# Altium schematic sheet PSU_MAX8860_ADJ.SchDoc: Power Supply MAX8860 (2V5)
size A4; DrawnBy: Brett Muir; SheetNumber: 10; SheetTotal: 12; PageSetup: Record=PageOptions|CenterHorizontal=True|CenterVertical=True|PrintScale=1.39|XCorrection=1.00|YCorrection=1.00|PrintKind=1|BorderSize=5000000|LeftOffset=0|BottomOffset=0|Orientation=2|PaperLength=1000|PaperWidth=1000|Scale=100|PaperSource=7|PrintQuality=1200|MediaType=1|DitherType=10|PaperKind=A3 (297 x 420 mm)|PrintScaleMode=1
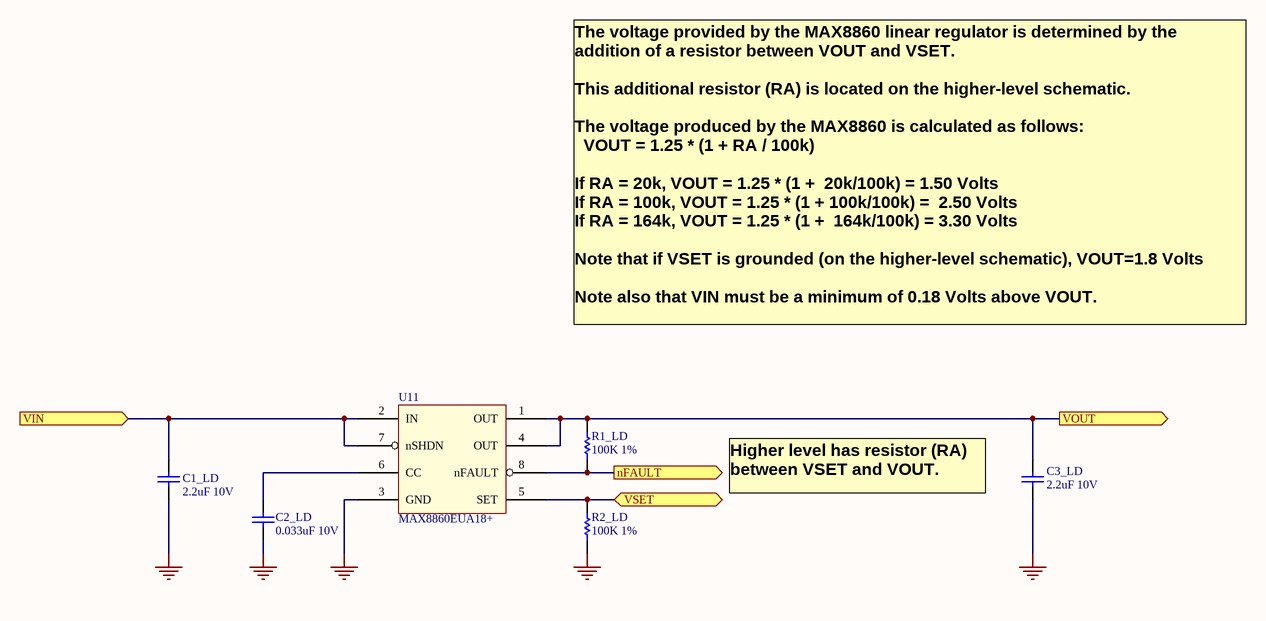
[diagram p0: PSU_MAX8860_ADJ.SchDoc]

## Parts
C1_LD  2.2uF 10V  [CAPC1608-STAR]
C2_LD  0.033uF 10V  [CAPC1005-STAR]
C3_LD  2.2uF 10V  [CAPC1608-STAR]
R1_LD  100K 1%  [RESC1005-STAR]
R2_LD  100K 1%  [RESC1005-STAR]
U11  MAX8860EUA18+  [SOP65P490-8]

## Ports
nFAULT (out), VIN (in), VOUT (out), VSET (bidir)

## Nets
GND: C1_LD.2 C2_LD.2 C3_LD.2 R2_LD.2 U11.3(GND)
nFAULT: R1_LD.2 U11.8(nFAULT) ; port nFAULT
VIN: C1_LD.1 U11.2(IN) U11.7(nSHDN) ; port VIN
VOUT: C3_LD.1 R1_LD.1 U11.1(OUT) U11.4(OUT) ; port VOUT
VSET: R2_LD.1 U11.5(SET) ; port VSET
NetC2_LD_1: C2_LD.1 U11.6(CC)

## Notes on the sheet
- The voltage provided by the MAX8860 linear regulator is determined by the addition of a resistor between VOUT and VSET.
  This additional resistor (RA) is located on the higher-level schematic.
  The voltage produced by the MAX8860 is calculated as follows:
  VOUT = 1.25 * (1 + RA / 100k)
  If RA = 20k,	VOUT = 1.25 * (1 +  20k/100k) = 1.50 Volts
  If RA = 100k,	VOUT = 1.25 * (1 + 100k/100k) =  2.50 Volts
  If RA = 164k,	VOUT = 1.25 * (1 +  164k/100k) = 3.30 Volts
  Note that if VSET is grounded (on the higher-level schematic), VOUT=1.8 Volts
  Note also that VIN must be a minimum of 0.18 Volts above VOUT.
- (near C3_LD) Higher level has resistor (RA) between VSET and VOUT.
- Sheet Title
- Project Title
- Size:
- Date:
- A4
- Assy:
- Time:
- Sheet
- Revision:
- of
- File:

## Library data of the parts
C1_LD C3_LD = D-101-0095: Capacitor, Ceramic, 2.2uF 10% 10V 0603 (1608) X5R; Polarity: Non-Polarized; Capacitance: 2.2 uF; Dielectric: X5R; Mounting Technology: Surface Mount; Rated Voltage: 10 V; Status: Unreleased; Technology: Ceramic; Tolerance: 10 %; Category: Capacitor
C2_LD = D-101-0105: Capacitor, Ceramic, 0.033uF 10% 10V 0402 (1005) X7R; Polarity: Non-Polarized; Capacitance: 0.033 uF; Dielectric: X7R; Mounting Technology: Surface Mount; Rated Voltage: 10 V; Status: Unreleased; Technology: Ceramic; Tolerance: 10 %; Category: Capacitor
R1_LD R2_LD = D-100-0132: Resistor, 100K 1% 0402 (1005); Power Rating: 63 mW; Mounting Technology: Surface Mount; Resistance: 100 K; Status: Production; Tolerance: 1 %; Category: Resistor
U11 = D-204-0016: MAX8860EUA18+, 1.8V Linear Regulator with adjustable Output, Low-noise, Low-dropout, 300mA, uMAX; Max Input Voltage: 6.5 V; Max Output Voltage: 5.5 V; Min Input Voltage: 2.5 V; Min Output Voltage: 1.25 V; Supply Voltage: 2.5 to 6.5 V; Max Output Current: 300 mA; Mounting Technology: Surface Mount; Status: Unreleased; Temperature Range: -40 to +85; Category: IC-Power